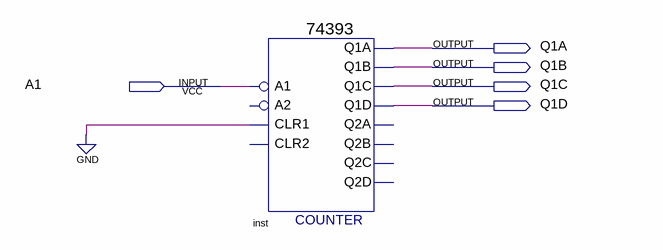
[diagram p0: schematic sheet]
// Quartus schematic lab6-3.bdf as structural Verilog: 1 symbols, 5 pins
module \lab6-3  (
  input  A1,
  output Q1A,
  output Q1B,
  output Q1C,
  output Q1D
);

  \74393  inst (
    .A1(A1), .CLR1(1'b0), .Q1C(Q1C), .Q1D(Q1D), .Q1A(Q1A), .Q1B(Q1B));  // open: A2, CLR2, Q2D, Q2C, Q2B, Q2A
endmodule
